# Altium schematic sheet Wildfire_Souce.schdoc
size 220 x 211 mm
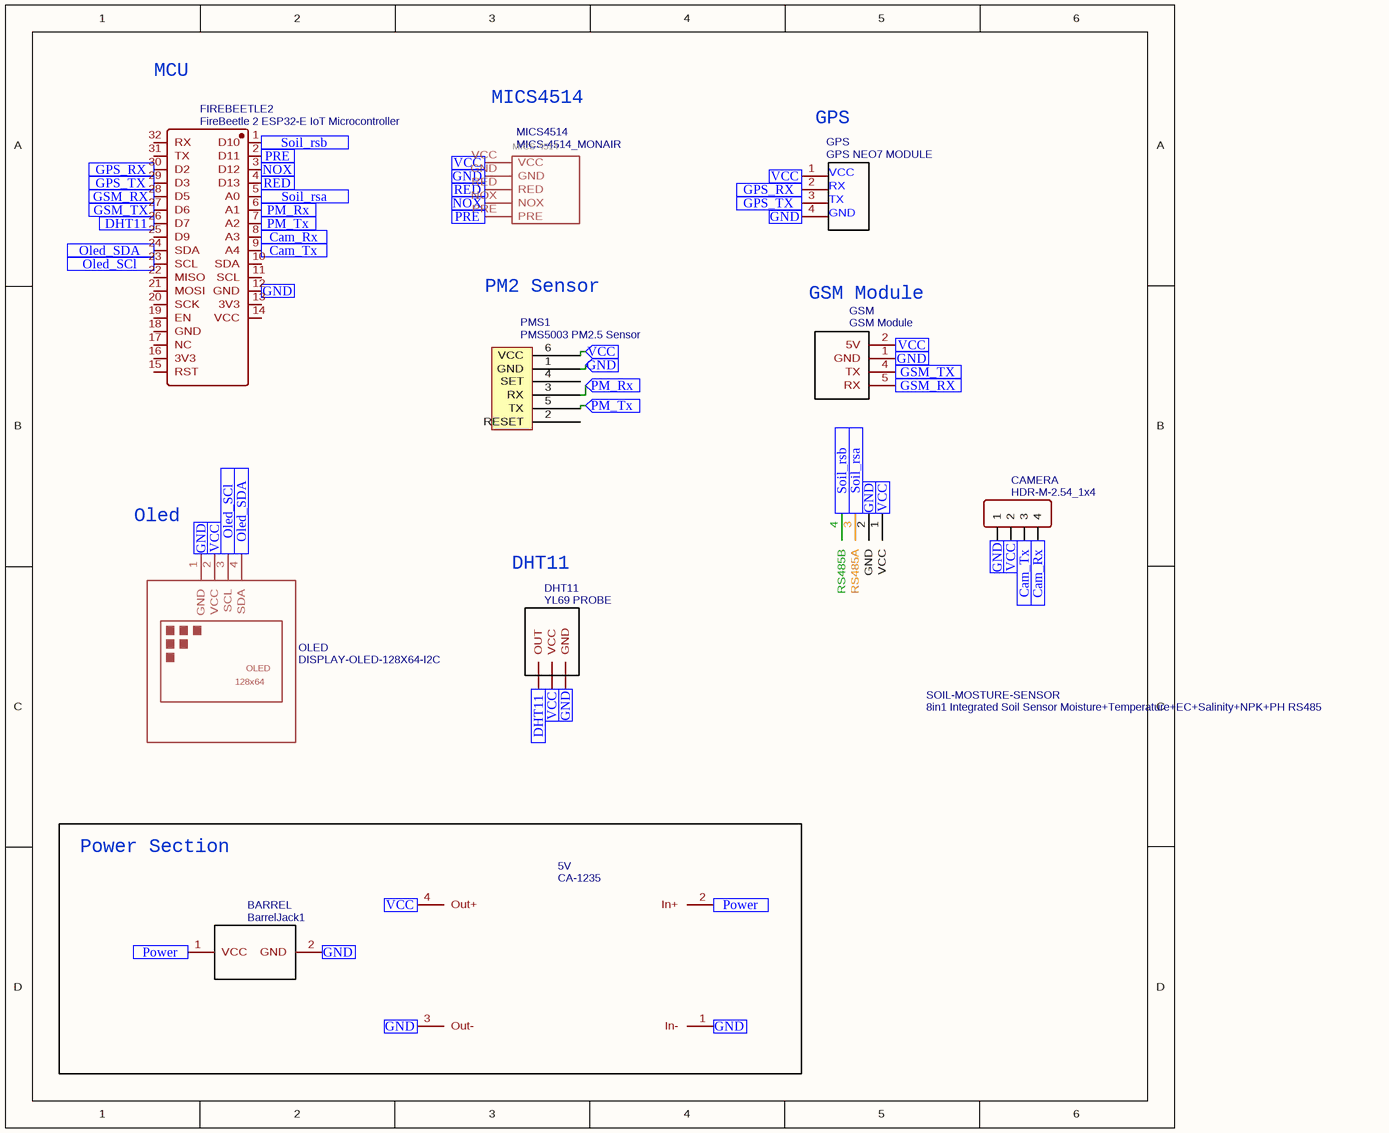
[diagram p0: Wildfire_Souce.schdoc]

## Parts
5V  CA-1235  [CA-1235]
BARREL  BarrelJack1  [BARRELJACKFC681478]
CAMERA  HDR-M-2.54_1x4  [HDR-M-2.54_1X4]
DHT11  YL69 PROBE  [HUMIDITY AND TEMPERATURE SENSOR]
FIREBEETLE2  FireBeetle 2 ESP32-E IoT Microcontroller  [FIREBEETLE 2 ESP32-E IOT MICROCONTROLLER]
GPS  GPS NEO7 MODULE  [GPS NEO7 MODULE]
GSM  GSM Module  [GSM MODULE]
MICS4514  MICS-4514_MONAIR  [MICS4514]
OLED  DISPLAY-OLED-128X64-I2C  [DISPLAY-OLED-128X64-I2C]
PMS1  PMS5003 PM2.5 Sensor  [PLANTOWER PM2.5 AIR SENSOR]
SOIL-MOSTURE-SENSOR  8in1 Integrated Soil Sensor Moisture+Temperature+EC+Salinity+NPK+PH RS485  [CONNECTOR_PINHEADER_2.54MM:PINHEADER_1X4]

## Blocks framed on the sheet
Power Section: 5V BARREL

## Ports
Cam_Rx (in), Cam_Tx (in), DHT11 (in), GND (in), GPS_RX (in), GPS_TX (in), GSM_RX (in), GSM_TX (in), NOX (in), Oled_SCl (in), Oled_SDA (in), PM_Rx (in), PM_Tx (in), Power (in), PRE (in), RED (in), Soil_rsa (in), Soil_rsb (in), VCC (in)

## Nets
Cam_Rx: CAMERA.4 FIREBEETLE2.8(A3) ; port Cam_Rx
Cam_Tx: CAMERA.3 FIREBEETLE2.9(A4) ; port Cam_Tx
DHT11: DHT11.OUT FIREBEETLE2.26(D7) ; port DHT11
GND: 5V.1(In-) 5V.3(Out-) BARREL.2(GND) CAMERA.1 DHT11.GND FIREBEETLE2.12(GND) GPS.4 GSM.1(GND) MICS4514.GND OLED.1(GND) PMS1.1(GND) SOIL-MOSTURE-SENSOR.2(GND) ; port GND
GPS_RX: FIREBEETLE2.30(D2) GPS.2 ; port GPS_RX
GPS_TX: FIREBEETLE2.29(D3) GPS.3 ; port GPS_TX
GSM_RX: FIREBEETLE2.28(D5) GSM.5(RX) ; port GSM_RX
GSM_TX: FIREBEETLE2.27(D6) GSM.4(TX) ; port GSM_TX
NOX: FIREBEETLE2.3(D12) MICS4514.NOX ; port NOX
Oled_SCl: FIREBEETLE2.23(SCL) OLED.3(SCL) ; port Oled_SCl
Oled_SDA: FIREBEETLE2.24(SDA) OLED.4(SDA) ; port Oled_SDA
PM_Rx: FIREBEETLE2.6(A1) PMS1.3(RX) ; port PM_Rx
PM_Tx: FIREBEETLE2.7(A2) PMS1.5(TX) ; port PM_Tx
Power: 5V.2(In+) BARREL.1(VCC) ; port Power
PRE: FIREBEETLE2.2(D11) MICS4514.PRE ; port PRE
RED: FIREBEETLE2.4(D13) MICS4514.RED ; port RED
Soil_rsa: FIREBEETLE2.5(A0) SOIL-MOSTURE-SENSOR.3(RS485A) ; port Soil_rsa
Soil_rsb: FIREBEETLE2.1(D10) SOIL-MOSTURE-SENSOR.4(RS485B) ; port Soil_rsb
VCC: 5V.4(Out+) CAMERA.2 DHT11.VCC GPS.1 GSM.2(5V) MICS4514.VCC OLED.2(VCC) PMS1.6(VCC) SOIL-MOSTURE-SENSOR.1(VCC) ; port VCC

Not connected (* = marked no-connect by the designer): FIREBEETLE2 10(SDA) 11(SCL) 13(3V3) 14(VCC) 15(RST) 16(3V3) 17(NC) 18(GND) 19(EN) 20(SCK) 21(MOSI) 22(MISO) 25(D9) 31(TX) 32(RX); PMS1 2(RESET) 4(SET)

## Notes on the sheet
- MCU
- MICS4514
- (near GPS) GPS
- PM2 Sensor
- (near GSM) GSM Module
- Oled
- DHT11
- (in symbol DISPLAY-OLED-128X64-I2C) 128x64
- (in symbol GPS NEO7 MODULE) VCC; RX; TX; GND
- (in symbol MICS-4514_MONAIR) MICS-4514

## Library data of the parts
5V = CA-1235: Contributor: Gregory Singleton; spicePre: U; spiceSymbolName: CA-1235
BARREL = BarrelJack1: Contributor: SamNewmanTekever; spicePre: U; spiceSymbolName: BarrelJack1
CAMERA = HDR-M-2.54_1x4: Contributor: LCEDA_Lib; Supplier Part: C124378; Supplier: LCSC; spicePre: J; spiceSymbolName: HDR-M-2.54_1x4
DHT11 = YL69 PROBE: Contributor: denislucietto2; spicePre: U; spiceSymbolName: YL69 PROBE
FIREBEETLE2 = FireBeetle 2 ESP32-E IoT Microcontroller: Manufacturer: DFRobot; Manufacturer Part: DFR0654-F; Contributor: liguorigiuseppe780; Supplier: AliExpress; Supplier Part: DFR0654-F; link: https://www.dfrobot.com/product-2231.html; spicePre: U; spiceSymbolName: FireBeetle 2 ESP32-E IoT Microcontroller
GPS = GPS NEO7 MODULE: Contributor: nguyenduythuc.utc2; spicePre: U; spiceSymbolName: GPS NEO7 MODULE
GSM = GSM Module: Contributor: Phocas Sebastian Sengo; Manufacturer Part: GSM Module; spicePre: U; spiceSymbolName: GSM Module
MICS4514 = MICS-4514_MONAIR: Contributor: Ex T; spicePre: G; spiceSymbolName: MICS-4514_MONAIR
OLED = DISPLAY-OLED-128X64-I2C: Contributor: gtanaka6; spicePre: ?; spiceSymbolName: DISPLAY-OLED-128X64-I2C
PMS1 = PMS5003 PM2.5 Sensor: Contributor: shyriu; spicePre: P; spiceSymbolName: PMS5003 PM2.5 Sensor
SOIL-MOSTURE-SENSOR = 8in1 Integrated Soil Sensor Moisture+Temperature+EC+Salinity+NPK+PH RS485: Contributor: Sutee.S; spicePre: J; spiceSymbolName: JST Connector 4 Pin; Supplier: IVT